# Altium schematic sheet data_interface.SchDoc
size A4; SheetNumber: 6; SheetTotal: 7
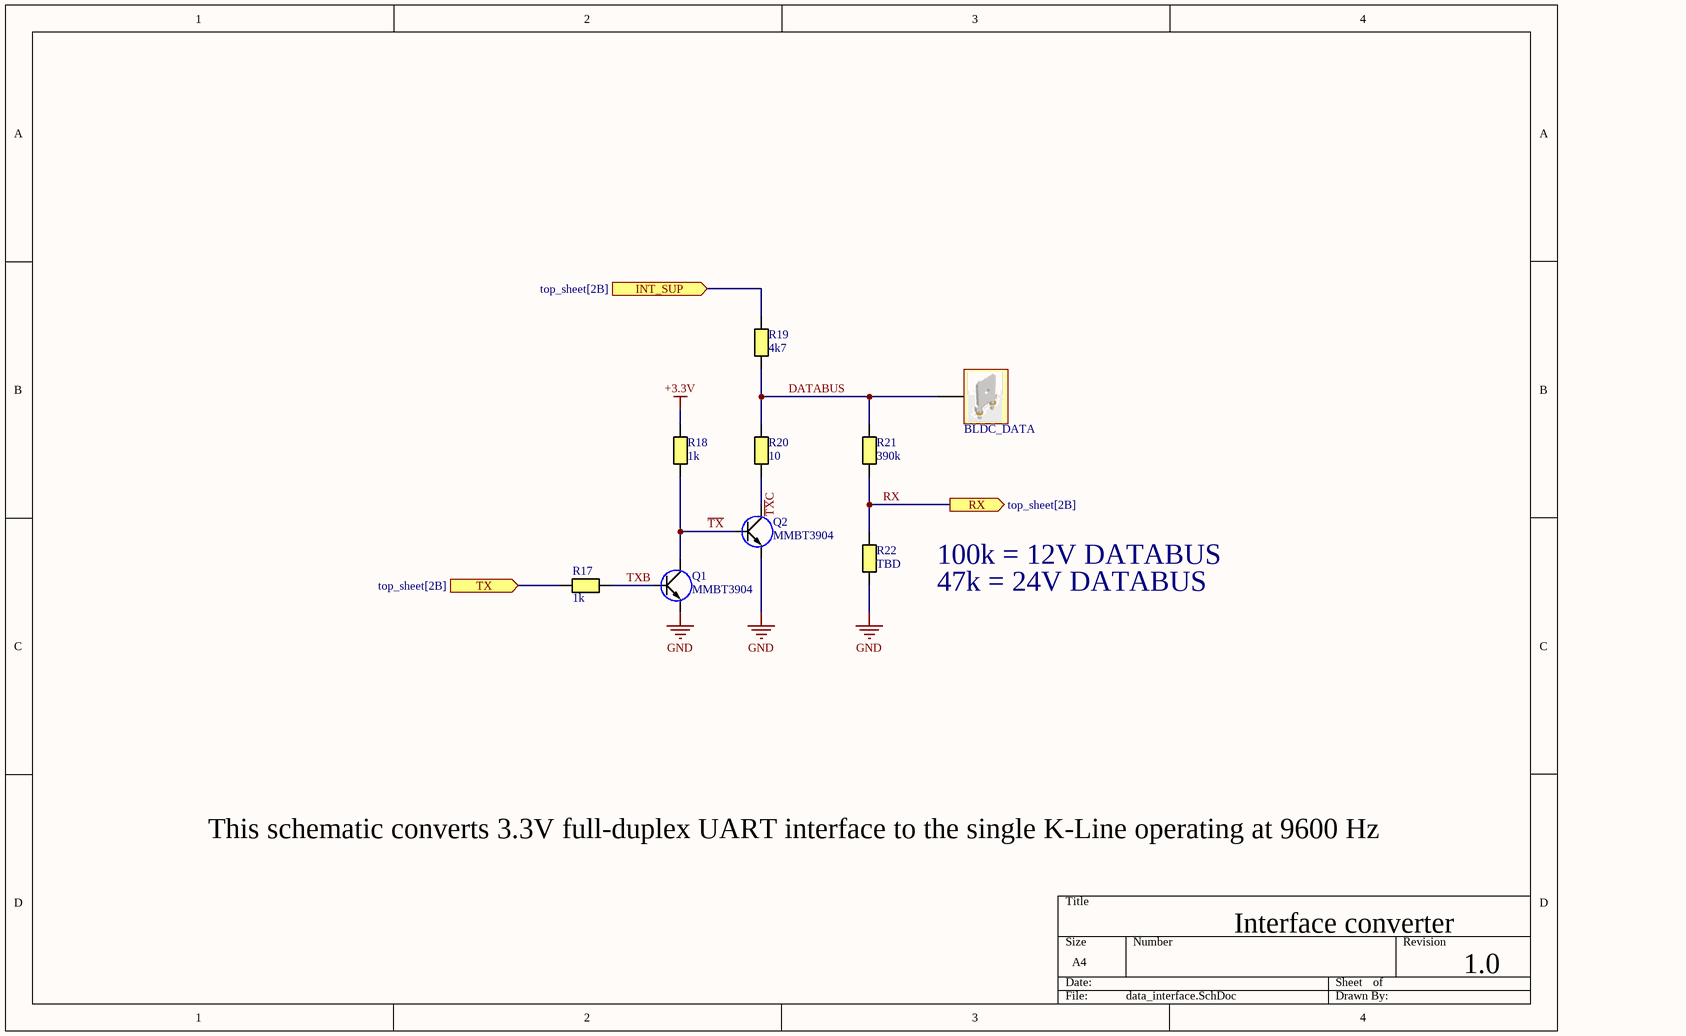
[diagram p0: data_interface.SchDoc]

## Parts
BLDC_DATA  Crimp 6.3 single PCB  [Crimp 6.3mm single PCB]  (value not drawn)
Q1  MMBT3904  [SOT23]
Q2  MMBT3904  [SOT23]
R17  1k  [RESC0603(1608)_N]
R18  1k  [RESC0603(1608)_N]
R19  4k7  [RESC0603(1608)_N]
R20  10  [RESC0603(1608)_N]
R21  390k  [RESC0603(1608)_N]
R22  TBD  [RESC0603(1608)_N]

## Ports
INT_SUP (in, see top_sheet[2B]), RX (out, see top_sheet[2B]), TX (in, see top_sheet[2B])

## Nets
+3.3V: R18.2
GND: Q1.2(E) Q2.2(E) R22.1
DATABUS: BLDC_DATA.1 R19.1 R20.2 R21.2
INT_SUP: R19.2 ; port INT_SUP
RX: R21.1 R22.2 ; port RX
~{TX}: Q1.3(C) Q2.1(B) R18.1
~{TX}C: Q2.3(C) R20.1
TX: R17.1 ; port TX
TXB: Q1.1(B) R17.2

## Notes on the sheet
- 100k = 12V DATABUS
- 47k = 24V DATABUS
- This schematic converts 3.3V full-duplex UART interface to the single K-Line operating at 9600 Hz
- Interface converter
- 1.0

## Library data of the parts
BLDC_DATA = Crimp 6.3 single PCB: Straight Mount Angle PCB Tab Terminal
Q1 Q2 = 2N3904: NPN General Purpose Transistor; Collector-Emitter Voltage: 40V; Collector-Base Voltage: 60V; Collector Current - Continuous: 200mA; DC Current Gain: 300
R17-R22 = Resistor M: Resistor Medium Density
  R17 R18: Value: 1k
  R19: Value: 4k7
  R20: Value: 10
  R21: Value: 390k
  R22: Value: TBD